# EasyEDA Pro project EasyEDApro.epro, schematic Power board
Create Date: 2024-05-27; Page Name: P1; Project Name: Robonomics SWS 2 GANG; Schematic Name: Power board; Update Date: 2024-05-27; Company: Robonomics.network; Drawed: ludovich88; Page Size: A4; Part Number: SWS-1G-E-ESP_PB; Reviewed: ludovich88; Version: V0.1
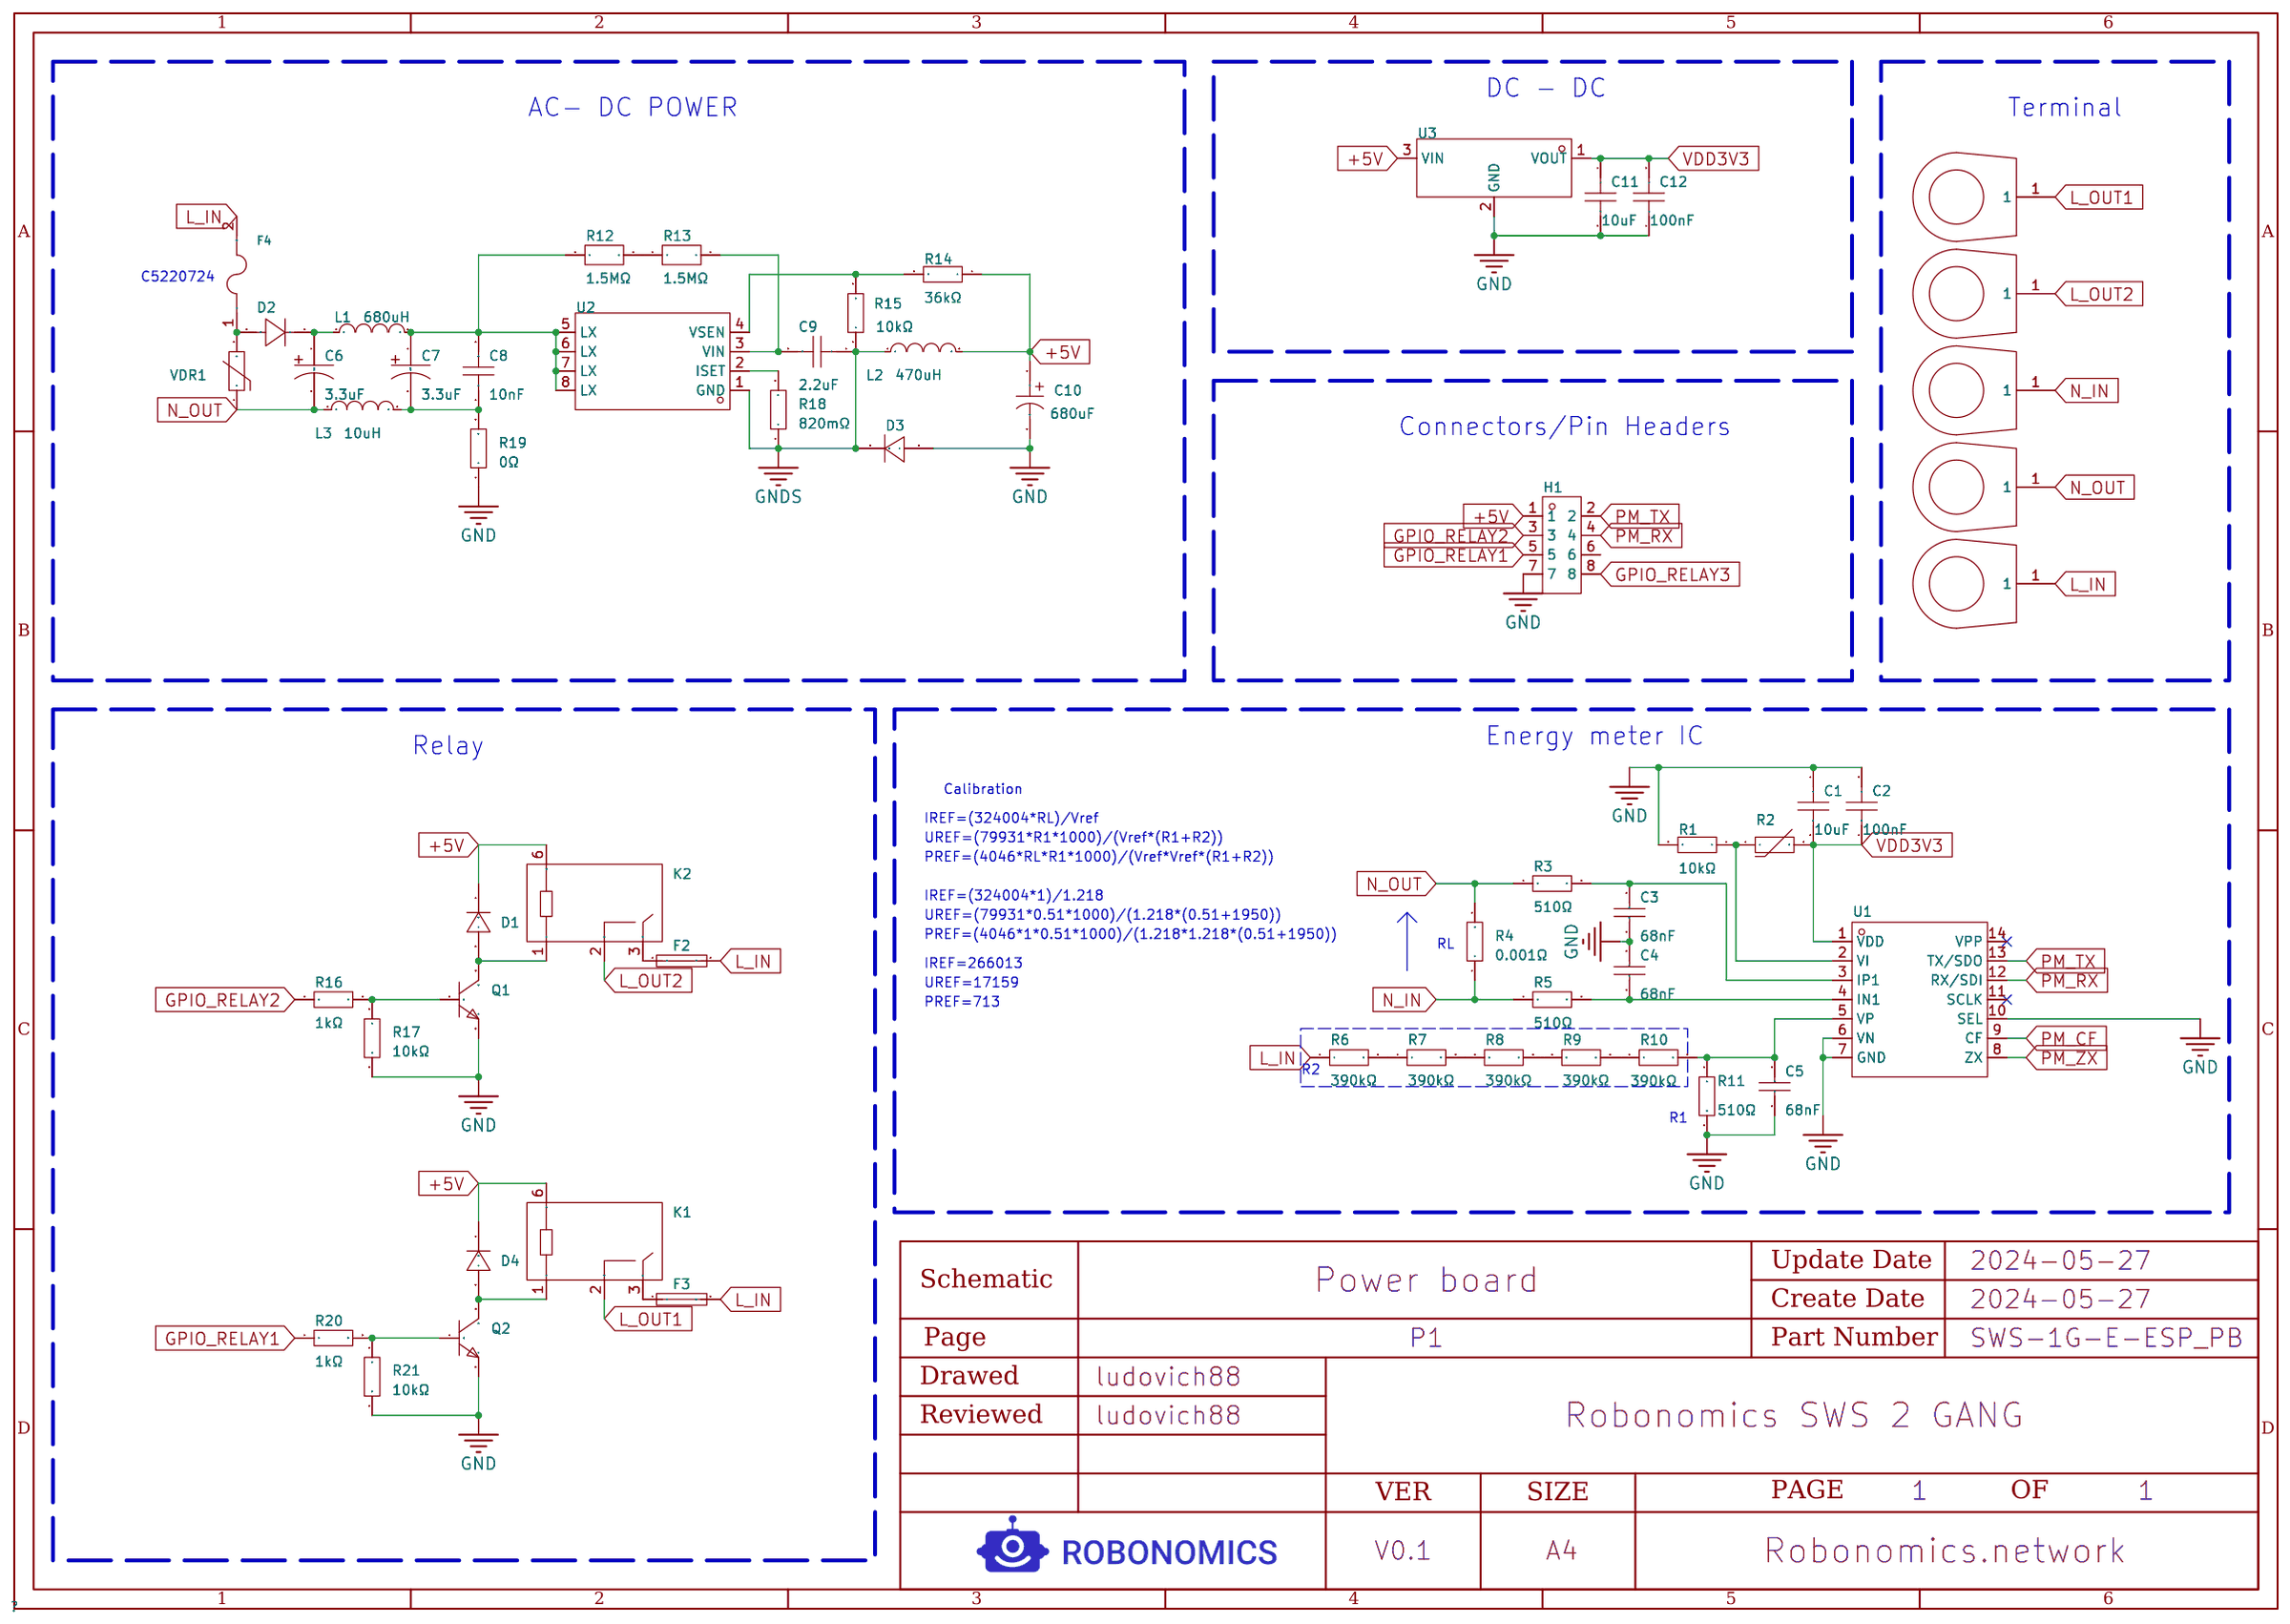
[diagram p0: schematic sheet]

## Parts
C1  10uF  [C0603]
C2  100nF  [C0603]
C3  68nF  [C0603]
C4  68nF  [C0603]
C5  68nF  [C0603]
C6  3.3uF  [CAP-TH_BD8.0-P3.50-D0.6-FD]
C7  3.3uF  [CAP-TH_BD8.0-P3.50-D0.6-FD]
C8  10nF  [C1206]
C9  2.2uF  [C0805]
C10  680uF  [CAP-TH_BD8.0-P3.50-D0.6-FD]
C11  10uF  [C0603]
C12  100nF  [C0603]
D1  -  [SOD-323_L1.8-W1.3-LS2.5-RD]
D2  -  [SMA_L4.3-W2.6-LS5.2-RD]
D3  -  [SMA_L4.3-W2.6-LS5.2-RD]
D4  -  [SOD-323_L1.8-W1.3-LS2.5-RD]
F2  -  [FUSE-SMD_L6.1-W2.6]
F3  -  [FUSE-SMD_L6.1-W2.6]
F4  JFC2410-1200FS  [F2410]
H1  -  [HDR-TH_8P-P2.00-V-M-R2-C4-S2.00]
K1  -  [RELAYS-TH_HF46F-G-XX-HS1-XXX]
K2  -  [RELAYS-TH_HF46F-G-XX-HS1-XXX]
L1  680uH  [IND-TH_BD9.0-P5.00-D0.7]
L2  470uH  [IND-SMD_L4.0-W4.0]
L3  10uH  [IND-SMD_L5.4-W5.2]
Q1  -  [SOT-23-3_L2.9-W1.6-P1.90-LS2.8-BR]
Q2  -  [SOT-23-3_L2.9-W1.6-P1.90-LS2.8-BR]
R1  10kΩ  [R0603]
R2  -  [R0805]
R3  510Ω  [R0603]
R4  0.001Ω  [RES-SMD_L6.3-W3.1-1]
R5  510Ω  [R0603]
R6  390kΩ  [R0603]
R7  390kΩ  [R0603]
R8  390kΩ  [R0603]
R9  390kΩ  [R0603]
R10  390kΩ  [R0603]
R11  510Ω  [R0603]
R12  1.5MΩ  [R1206]
R13  1.5MΩ  [R1206]
R14  36kΩ  [R0805]
R15  10kΩ  [R0805]
R16  1kΩ  [R0603]
R17  10kΩ  [R0603]
R18  820mΩ  [R0805]
R19  0Ω  [R0805]
R20  1kΩ  [R0603]
R21  10kΩ  [R0603]
U1  -  [TSSOP-14_L5.0-W4.4-P0.65-LS6.4-BL]
U2  -  [SOIC-8_L4.9-W3.9-P1.27-LS6.0-BL]
U3  -  [SOT-89-3_L4.5-W2.5-P1.50-LS4.2-BR]
U4  -  [screw_china_vadim]  (no BOM)
U5  -  [screw_china_vadim]  (no BOM)
U6  -  [screw_china_vadim]  (no BOM)
U7  -  [screw_china_vadim]  (no BOM)
U8  -  [screw_china_vadim]  (no BOM)
VDR1  RM07D471KC14E100  [RES-TH_L9.5-W3.8-P5.08-D0.6-S2.5]

## Library data of the parts
C1 C11 = CL10A106MQ8NNNC: Capacitance:Tolerance:±20%Tolerance:±20%VoltageRated:TemperatureCoefficient:; LCSC Part Name: 10uF±20%6.3V; Supplier Part: C1691; Manufacturer: SAMSUNG(三星); Supplier Footprint: 0603; JLCPCB Part Class: ExtendedPart; Datasheet: https://atta.szlcsc.com/upload/public/pdf/source/20160103/1457707690948.pdf; Supplier: LCSC; Tolerance: ±20%
C2 C12 = 0603ZC104KAT2A: Capacitance:Tolerance:±10%Tolerance:±10%VoltageRated:TemperatureCoefficient:; LCSC Part Name: 100nF±10%10V; Supplier Part: C597251; Manufacturer: KyoceraAVX; Supplier Footprint: 0603; Datasheet: https://atta.szlcsc.com/upload/public/pdf/source/20200611/C596996_5C2870FCBE04273D0B42880C13DA8C38.pdf; Supplier: LCSC; Tolerance: ±10%
C3-C5 = CC0603KRX7R9BB683: Capacitance:Tolerance:±10%Tolerance:±10%VoltageRated:TemperatureCoefficient:; LCSC Part Name: 68nF±10%50V; Supplier Part: C107098; Manufacturer: YAGEO(国巨); Supplier Footprint: 0603; JLCPCB Part Class: ExtendedPart; Datasheet: https://atta.szlcsc.com/upload/public/pdf/source/20170420/1492670727030.pdf; Supplier: LCSC; Tolerance: ±10%
C6 C7 = RC400M3R3LO8*12TH-2A1E: Capacitance:Tolerance:±20%Tolerance:±20%RatedVoltage:φD:L:LeadSpacing:RippleCurrent:-Lifetime@Temp:-OperatingTemperature:-40℃~+105℃OperatingTemperature:-40℃~+105℃; LCSC Part Name: 3.3uF±20%400V; Supplier Part: C357600; Manufacturer: BERYL(绿宝石); Supplier Footprint: 插件,D8xL12mm; JLCPCB Part Class: ExtendedPart; Datasheet: https://atta.szlcsc.com/upload/public/pdf/source/20190103/C357600_EA153F20CFA28085E3801EB936F22A0F.pdf; Supplier: LCSC; Tolerance: ±20%; Operating Temperature: -40℃~+105℃
C8 = 1206B103K102CT_C77498: Capacitance:Tolerance:±10%Tolerance:±10%VoltageRated:TemperatureCoefficient:; LCSC Part Name: 10nF±10%1kV; Supplier Part: C77498; Manufacturer: Walsin(华新科); Manufacturer Part: 1206B103K102CT; Supplier Footprint: 1206; Datasheet: https://atta.szlcsc.com/upload/public/pdf/source/20180823/C77498_F5DB9DEE771DDE1CDD0779C01702A5D3.pdf; Supplier: LCSC; Tolerance: ±10%
C9 = CL21A225KBQNNNE: Capacitance:Tolerance:±10%Tolerance:±10%VoltageRated:TemperatureCoefficient:; LCSC Part Name: 2.2uF±10%50V; Supplier Part: C377773; Manufacturer: SAMSUNG(三星); Supplier Footprint: 0805; JLCPCB Part Class: ExtendedPart; Datasheet: https://atta.szlcsc.com/upload/public/pdf/source/20190327/C377773_F663556E8B678C5EA7A210E6B154453B.pdf; Supplier: LCSC; Tolerance: ±10%
C10 = EPPC1C681M08112BS: Type:Capacitance:Tolerance:±20%Tolerance:±20%RatedVoltage:φD:-L:-LeadSpacing:-RippleCurrent:-EquivalentSeriesResistance(ESR):-Lifetime@Temp:-; LCSC Part Name: 680uF±20%16V; Supplier Part: C2803468; Manufacturer: FSD-CON(富仕达); Supplier Footprint: 径向引线,8x12mm; JLCPCB Part Class: ExtendedPart; Datasheet: https://atta.szlcsc.com/upload/public/pdf/source/20210616/C2803468_7FB11B187CD21C9D4AD2E759CF8C7DA5.pdf; Supplier: LCSC; Tolerance: ±20%
D1 D4 = 1N4148WS-7-F: DiodeConfiguration:PowerDissipation:ReverseVoltage(Vr):AverageRectifiedCurrent(Io):ForwardVoltage(Vf@If):1.25V@150mAReverseLeakageCurrent:1uA@75VReverseRecoveryTime(trr):OperatingTemperature:-65℃~+150℃@(Tj)OperatingTemperature:-65℃; LCSC Part Name: 75V150mA4ns; Supplier Part: C60580; Manufacturer: DIODES(美台); Supplier Footprint: SOD-323; Datasheet: https://atta.szlcsc.com/upload/public/pdf/source/20160107/1457707747110.pdf; Supplier: LCSC; Forward Voltage (Vf@If): 1.25V@150mA; Reverse Leakage Current: 1uA@75V; Operating Temperature: -65℃~+150℃@(Tj)
D2 = 1N4007_C2909962: DiodeConfiguration:ReverseVoltage(Vr):AverageRectifiedCurrent(Io):ForwardVoltage(Vf@If):1.1V@1AReverseLeakageCurrent:5uA@1kV; LCSC Part Name: 1kV1A1.1V@1A; Supplier Part: C2909962; Manufacturer: YONGYUTAI(永裕泰); Manufacturer Part: 1N4007; Supplier Footprint: SMA; JLCPCB Part Class: ExtendedPart; Datasheet: https://atta.szlcsc.com/upload/public/pdf/source/20211027/3C3C26B7E3DDAB11EE78A0D524F57BB8.pdf; Supplier: LCSC; Forward Voltage (Vf@If): 1.1V@1A; Reverse Leakage Current: 5uA@1kV
D3 = ES1J_C115404: LCSC Part Name: ES1J; Supplier Part: C115404; Manufacturer: 晶导微电子; Manufacturer Part: ES1J; Supplier Footprint: SMA(DO-214AC); Datasheet: https://atta.szlcsc.com/upload/public/pdf/source/20170704/1499151315665.pdf; Supplier: LCSC
F2 F3 = 24E1700A: FuseType:-BreakingCapacity@RatedVoltage:50AProduct:SMDCeramicFuseOperatingTemperature:RatedVoltage(DC):CurrentRating:NominalVoltageDrop:-MeltingI²t:RatedVoltage(AC):250VNominalColdResistance:-; LCSC Part Name: 7A250V熔断式; Supplier Part: C182452; Manufacturer: LANSON(良胜); Supplier Footprint: SMD; JLCPCB Part Class: ExtendedPart; Datasheet: https://atta.szlcsc.com/upload/public/pdf/source/20180301/C182452_15198945619091384126.pdf; Supplier: LCSC; Breaking Capacity @ Rated Voltage: 50A; Product: SMDCeramicFuse; Rated Voltage(AC): 250V
F4 = JFC2410-1200FS: Type:SMD Fuse Current Rating:2A Voltage Rating  (AC):250V Breaking Capacity:50A Operating Temperature:-55℃~+125℃ Operating Temperature:-55℃~+125℃; LCSC Part Name: 250V贴片式保险丝; Supplier Part: C136365; Manufacturer: JDTfuse(集电通); Supplier Footprint: SMD; JLCPCB Part Class: Extended Part; Datasheet: https://atta.szlcsc.com/upload/public/pdf/source/20230515/4DD82964BD259009D7CA201DAB95185E.pdf; Supplier: LCSC; Type: SMD Fuse; Current Rating: 2A; Voltage Rating  (AC): 250V; Breaking Capacity: 50A; Operating Temperature: -55℃~+125℃
H1 = DZ200R-22-08-39: NumberofRows:双排NumberofPins:8Pitch:2mmPinStructure:2x4PRowSpacing:2mmMountingType:StraightCircluarPins/SquarePins:SquarePinsCurrentRating(Max):1.5AVoltageRating(Max):-LengthofMatingPin:3.9mmInsulationHeight:2mmLengthofEndCo; LCSC Part Name: 2mm2x4P直插方针; Supplier Part: C2935959; Manufacturer: DEALON(德艺隆); Supplier Footprint: 插件,P=2mm; Datasheet: https://atta.szlcsc.com/upload/public/pdf/source/20211231/68D7D2A8F9A773B01A999B43160B79F2.pdf; Supplier: LCSC; Number of Rows: 双排; Number of Pins: 8; Pitch: 2mm; Pin Structure: 2x4P; Row Spacing: 2mm; Mounting Type: Straight; Circluar Pins/Square Pins: SquarePins; Current Rating (Max): 1.5A; Length of Mating Pin: 3.9mm; Insulation Height: 2mm; Length of End Connection Pin: 2.7mm
K1 K2 = HF46F-G/005-HS1: CoilVoltage:5VCoilType:非极化-单线圈PinNumber:4ContactForm:一组常开:1A(SPST-常开)MaximumSwitchingCurrent:10AMaximumSwitchingVoltage:277V@AC；30V@DCCoilRatedPower:200mWContactRating:10A@250VAC；10A@30VDCCoilResistance:125ΩOperateTime:10msReleaseT; Supplier Part: C2976854; Manufacturer: HF(宏发); Supplier Footprint: 插件,7x20.5mm; Datasheet: https://atta.szlcsc.com/upload/public/pdf/source/20220224/E14005FDD5D9726CCDC1C5F41EB581E0.pdf; Supplier: LCSC; Coil Voltage: 5V; Coil Type: 非极化-单线圈; Pin Number: 4; Contact Form: 一组常开:1A(SPST-常开); Maximum Switching Current: 10A; Maximum Switching Voltage: 277V@AC；30V@DC; Coil Rated Power: 200mW; Contact Rating: 10A@250VAC；10A@30VDC; Coil Resistance: 125Ω; Operate Time: 10ms; Release Time: 10ms; Contact Resistance: 100mΩ; Contact Material: AgNi; Operating Temperature: -40℃~+85℃
L1 = PK0810-681KB: Inductance:Tolerance:Tolerance:RatedCurrent:DCResistance(DCR):-; LCSC Part Name: 680uH±10%350mA; Supplier Part: C400320; Manufacturer: SXN(顺翔诺); Supplier Footprint: 径向引线; JLCPCB Part Class: ExtendedPart; Datasheet: https://atta.szlcsc.com/upload/public/pdf/source/20210810/BA6D1DA7D4BCBB7C641BC97B42CFC6FF.pdf; Supplier: LCSC
L2 = PNLS4030-471: Inductance: Tolerance:±20% Tolerance:±20% Rated Current: Type:磁胶电感 DC Resistance (DCR): Saturation Current (Isat):- Ratings:-; LCSC Part Name: 470uH ±20%; Supplier Part: C2849480; Manufacturer: DMBJ(振宝佳); Supplier Footprint: SMD,4x4x3mm; JLCPCB Part Class: Extended Part; Datasheet: https://atta.szlcsc.com/upload/public/pdf/source/20211011/C2849563_90EF936162E15AB6B17B47214801A168.pdf; Supplier: LCSC; Tolerance: ±20%; Type: 磁胶电感; DC Resistance (DCR): 2.57Ω
L3 = YSPI0530-100M: RatedCurrent:Inductance:Length:Tolerance:Width:DCResistance(DCR):Height:Tolerance:; LCSC Part Name: 10uH±20%2.5A115mΩ; Supplier Part: C351099; Manufacturer: YJYCOIN(益嘉源); Supplier Footprint: SMD,5.4x5.2x3mm; Datasheet: https://atta.szlcsc.com/upload/public/pdf/source/20200623/C351094_17389D97D1B03B4819FE4163F927344F.pdf; Supplier: LCSC
Q1 Q2 = SS8050_C181160: TransistorType:Collector-EmitterBreakdownVoltage(Vceo):CollectorCurrent(Ic):PowerDissipation(Pd):CollectorCut-OffCurrent(Icbo):100nACollector-EmitterSaturationVoltage(VCE(sat)@Ic,Ib):500mV@800mA,80mADCCurrentGain(hFE@Ic,Vce):200@100; LCSC Part Name: NPN25V1.5AH档（200-350）; Supplier Part: C181160; Manufacturer: Hottech(合科泰); Manufacturer Part: SS8050; Supplier Footprint: SOT-23; JLCPCB Part Class: ExtendedPart; Datasheet: https://atta.szlcsc.com/upload/public/pdf/source/20220506/87BBA77FEE9CB4B19031AE933C67329E.pdf; Supplier: LCSC; Collector Cut-Off Current (Icbo): 100nA; Collector-Emitter Saturation Voltage (VCE(sat)@Ic,Ib): 500mV@800mA,80mA; DC Current Gain (hFE@Ic,Vce): 200@100mA,1V; Transition Frequency (fT): 100MHz; Operating Temperature: +150℃@(Tj)
R1 R17 R21 = 0603WAF1002T5E: Resistance:10000Ω Tolerance:±1% Tolerance:±1% Power(Watts): Overload Voltage (Max): Temperature Coefficient:±100ppm/℃ Temperature Coefficient:±100ppm/℃ Type:Thick Film Resistors Operating Temperature Range:-55℃~+155℃ Operating Temperature Range:-55℃~+155℃; LCSC Part Name: 10kΩ ±1% 100mW 厚膜电阻; Supplier Part: C25804; Manufacturer: UNI-ROYAL(厚声); Supplier Footprint: 0603; JLCPCB Part Class: Basic Part; Datasheet: https://atta.szlcsc.com/upload/public/pdf/source/20200306/C422600_1E6D84923E4A46A82E41ADD87F860B5C.pdf; Supplier: LCSC; Tolerance: ±1%; Power(Watts): 1/10W; Overload Voltage (Max): 75V; Temperature Coefficient: ±100ppm/℃; Type: Thick Film Resistors; Operating Temperature Range: -55℃~+155℃
R2 = SDNT2012X103F3950FTF: Resistance@25℃:ResistanceTolerance:BConstantTolerance:BConstant(25℃/50℃):Power:SteadyStateCurrent(Max):0.44mABConstant(25℃/75℃):-BConstant(25℃/85℃):-BConstant(25℃/100℃):-OperatingTemperature:-55℃~+125℃OperatingTemperature:-55℃~; LCSC Part Name: 10kΩ电阻精度:±1%3950K; Supplier Part: C95968; Manufacturer: Sunlord(顺络); Supplier Footprint: 0805; JLCPCB Part Class: ExtendedPart; Datasheet: https://atta.szlcsc.com/upload/public/pdf/source/20210916/BF106A3565EDFEB141CB3E0EA3A661F8.pdf; Supplier: LCSC; Steady State Current (Max): 0.44mA; Operating Temperature: -55℃~+125℃
R3 R5 R11 = 0603WAD5100T5E: Resistance: Tolerance:±0.5% Tolerance:±0.5% Power(Watts): Overload Voltage (Max): Temperature Coefficient:±100ppm/℃ Temperature Coefficient:±100ppm/℃ Type:Thick Film Resistors Operating Temperature Range:-55℃~+155℃ Operating Temperature Range:-55℃~+155℃; LCSC Part Name: 510Ω ±0.5% 100mW 厚膜电阻; Supplier Part: C423029; Manufacturer: UNI-ROYAL(厚声); Supplier Footprint: 0603; JLCPCB Part Class: Extended Part; Datasheet: https://atta.szlcsc.com/upload/public/pdf/source/20200306/C422600_1E6D84923E4A46A82E41ADD87F860B5C.pdf; Supplier: LCSC; Tolerance: ±0.5%; Temperature Coefficient: ±100ppm/℃; Type: Thick Film Resistors; Operating Temperature Range: -55℃~+155℃
R4 = EWSL2512F1L00S9: Tolerance:MountingSytle:SurfaceMountBodyLength:-BodyWidth:-BodyHeight:-Power(Watts):TemperatureCoefficient:TemperatureCoefficient:LeadSpacing:-Resistance:Type:CurrentSensingResistorsRatedCurrent:-RatedOutputVoltage:-; LCSC Part Name: 0.001Ω±1%; Supplier Part: C349153; Manufacturer: RESI(开步睿思）; Supplier Footprint: 2512; JLCPCB Part Class: ExtendedPart; Datasheet: https://atta.szlcsc.com/upload/public/pdf/source/20181218/C349153_CC7FEA2167C118B4D238105DB1321D0D.pdf; Supplier: LCSC; Mounting Sytle: SurfaceMount; Type: CurrentSensingResistors
R6-R10 = 0603WAF3903T5E: Type:Thick Film Resistors Resistance: Tolerance:±1% Tolerance:±1% Power(Watts): Temperature Coefficient:±100ppm/ Temperature Coefficient:±100ppm/ Overload Voltage (Max): Operating Temperature Range:-55~+155 Operating Temperature Range:-55~+155; LCSC Part Name: 390kΩ±1%100mW; Supplier Part: C23150; Manufacturer: UNI-ROYAL(厚声); Supplier Footprint: 0603; JLCPCB Part Class: BasicPart; Datasheet: https://atta.szlcsc.com/upload/public/pdf/source/20200306/C422600_1E6D84923E4A46A82E41ADD87F860B5C.pdf; Supplier: LCSC; Type: ThickFilmResistors; Tolerance: ±1%; Temperature Coefficient: ±100ppm/; Operating Temperature Range: -55~+155
R12 R13 = AC1206FR-071M5L: Power(Watts):250mWBodyLength:-Tolerance:OperatingTemperatureRange:OperatingTemperatureRange:φD:-BodyHeight:-Resistance:BodyWidth:-Type:ThickFilmResistorsTemperatureCoefficient:TemperatureCoefficient:OverloadVoltage(Max):; LCSC Part Name: 1.5MΩ±1%; Supplier Part: C229411; Manufacturer: YAGEO(国巨); Supplier Footprint: 1206; JLCPCB Part Class: ExtendedPart; Datasheet: https://atta.szlcsc.com/upload/public/pdf/source/20190415/C229411_FA1574342AB9C159EA3612F925293BBE.pdf; Supplier: LCSC; Power(Watts): 250mW; Type: ThickFilmResistors
R14 = 0805W8F3602T5E: Type:ThickFilmResistorsResistance:Tolerance:±1%Tolerance:±1%Power(Watts):TemperatureCoefficient:±100ppm/℃TemperatureCoefficient:±100ppm/℃OverloadVoltage(Max):OperatingTemperatureRange:-55℃~+155℃OperatingTemperatureRange:-55℃~+155℃; LCSC Part Name: 36kΩ±1%125mW; Supplier Part: C4360; Manufacturer: UNI-ROYAL(厚声); Supplier Footprint: 0805; JLCPCB Part Class: BasicPart; Datasheet: https://atta.szlcsc.com/upload/public/pdf/source/20200306/C422600_1E6D84923E4A46A82E41ADD87F860B5C.pdf; Supplier: LCSC; Type: ThickFilmResistors; Tolerance: ±1%; Temperature Coefficient: ±100ppm/℃; Operating Temperature Range: -55℃~+155℃
R15 = 0805W8F1002T5E: Type:ThickFilmResistorsResistance:Tolerance:±1%Tolerance:±1%Power(Watts):TemperatureCoefficient:±100ppm/℃TemperatureCoefficient:±100ppm/℃OverloadVoltage(Max):OperatingTemperatureRange:-55℃~+155℃OperatingTemperatureRange:-55℃~+155℃; LCSC Part Name: 10kΩ±1%125mW; Supplier Part: C17414; Manufacturer: UNI-ROYAL(厚声); Supplier Footprint: 0805; JLCPCB Part Class: BasicPart; Datasheet: https://atta.szlcsc.com/upload/public/pdf/source/20200306/C422600_1E6D84923E4A46A82E41ADD87F860B5C.pdf; Supplier: LCSC; Type: ThickFilmResistors; Tolerance: ±1%; Temperature Coefficient: ±100ppm/℃; Operating Temperature Range: -55℃~+155℃
R16 R20 = 0603WAF1001T5E: Resistance:1000Ω Tolerance:±1% Tolerance:±1% Power(Watts): Overload Voltage (Max): Temperature Coefficient:±100ppm/℃ Temperature Coefficient:±100ppm/℃ Type:Thick Film Resistors Operating Temperature Range:-55℃~+155℃ Operating Temperature Range:-55℃~+155℃; LCSC Part Name: 1kΩ ±1% 100mW 厚膜电阻; Supplier Part: C21190; Manufacturer: UNI-ROYAL(厚声); Supplier Footprint: 0603; JLCPCB Part Class: Basic Part; Datasheet: https://atta.szlcsc.com/upload/public/pdf/source/20200306/C422600_1E6D84923E4A46A82E41ADD87F860B5C.pdf; Supplier: LCSC; Tolerance: ±1%; Temperature Coefficient: ±100ppm/℃; Type: Thick Film Resistors; Operating Temperature Range: -55℃~+155℃
R18 = 0805W8F820LT5E: Type:ThickFilmResistorsResistance:820mΩTolerance:±1%Tolerance:±1%Power(Watts):TemperatureCoefficient:±800ppm/℃TemperatureCoefficient:±800ppm/℃OverloadVoltage(Max):OperatingTemperatureRange:-55℃~+155℃OperatingTemperatureRange:-55℃~+155℃; LCSC Part Name: 820mΩ±1%125mW; Supplier Part: C25267; Manufacturer: UNI-ROYAL(厚声); Supplier Footprint: 0805; JLCPCB Part Class: ExtendedPart; Datasheet: https://atta.szlcsc.com/upload/public/pdf/source/20200306/C422600_1E6D84923E4A46A82E41ADD87F860B5C.pdf; Supplier: LCSC; Type: ThickFilmResistors; Tolerance: ±1%; Temperature Coefficient: ±800ppm/℃; Operating Temperature Range: -55℃~+155℃
R19 = 0805W8J0000T5E: Type:ThickFilmResistorsResistance:Tolerance:±5%Tolerance:±5%Power(Watts):OverloadVoltage(Max):OperatingTemperatureRange:-55℃~+155℃OperatingTemperatureRange:-55℃~+155℃; LCSC Part Name: 0Ω±5%125mW; Supplier Part: C25275; Manufacturer: UNI-ROYAL(厚声); Supplier Footprint: 0805; Datasheet: https://atta.szlcsc.com/upload/public/pdf/source/20200306/C422600_1E6D84923E4A46A82E41ADD87F860B5C.pdf; Supplier: LCSC; Type: ThickFilmResistors; Tolerance: ±5%; Operating Temperature Range: -55℃~+155℃
U1 = BL0940: LCSC Part Name: 电能计量芯片; Supplier Part: C691894; Manufacturer: BL(上海贝岭); Supplier Footprint: TSSOP-14; JLCPCB Part Class: ExtendedPart; Datasheet: https://atta.szlcsc.com/upload/public/pdf/source/20200628/C691894_DF23B4F5A06D0F64D9A7C5BC935783C1.pdf; Supplier: LCSC
U2 = SY50282FAC: Supplier Part: C178237; Manufacturer: silergy(矽力杰); Supplier Footprint: SOIC-8; JLCPCB Part Class: ExtendedPart; Datasheet: https://atta.szlcsc.com/upload/public/pdf/source/20180207/C178237_15179896323851356347.pdf; Supplier: LCSC
U3 = LD2981ABU33TR: OutputType:OutputPolarity:PositiveNumberofOutputs:1MaximumInputVoltage:16VOutputVoltage:3.3V~3.3VOutputVoltage:3.3V~3.3VDropoutVoltage:375mV@(100mA)OutputCurrent:100mAPowerSupplyRejectionRatio(PSRR):63dB@(1kHz); LCSC Part Name: 正Vin=16VVout=3.3V100mA63dB@(1kHz); Supplier Part: C221514; Manufacturer: ST(意法半导体); Supplier Footprint: SOT-89-3; JLCPCB Part Class: ExtendedPart; Datasheet: https://atta.szlcsc.com/upload/public/pdf/source/20180517/C221514_2D86246316B4A3FA0379065A5BE313C7.pdf; Supplier: LCSC; Output Polarity: Positive; Number of Outputs: 1; Maximum Input Voltage: 16V; Output Voltage: 3.3V~3.3V; Dropout Voltage: 375mV@(100mA); Output Current: 100mA; Power Supply Rejection Ratio (PSRR): 63dB@(1kHz)
U4-U8 = screw_china_vadim
VDR1 = RM07D471KC14E100: Varistor Voltage:470V Varistor Voltage:470V Clamping Voltage: Allowable Voltage (DC): Allowable Voltage (AC): Peak Current:1250A Maximum Energy:29J Maximum Energy:29J Typical Capatitance:105pF@1kHz Rated Wattage:0.25W; LCSC Part Name: 钳位电压775V 29焦耳 插件压敏电阻; Supplier Part: C2974819; Manufacturer: Dersonic(德尔创); Supplier Footprint: 插件,P=5.08mm; JLCPCB Part Class: Extended Part; Datasheet: https://atta.szlcsc.com/upload/public/pdf/source/20220216/D8DC692F05B9B06F05572F275B453E59.pdf; Supplier: LCSC; Varistor Voltage: 470V; Peak Current: 1250A; Maximum Energy: 29J; Typical Capatitance: 105pF@1kHz; Rated Wattage: 0.25W

## Nets
+5V: C10.1 D1.1(C) D4.1(C) H1.1 K1.6 K2.6 L2.2 R14.1 U3.3(VIN)
GND: C1.1 C2.2 C3.1 C4.2 C5.1 C10.2 C11.2 C12.1 D3.2(A) H1.7 Q1.2(E) Q2.2(E) R1.2 R11.2 R17.2 R19.1 R21.2 U1.6(VN) U1.7(GND) U1.10(SEL) U3.2(GND)
GNDS: C9.1 D3.1(C) L2.1 R15.1 R18.1 U2.1(GND)
VDD3V3: C1.2 C2.1 C11.1 C12.2 R2.2 U1.1(VDD) U3.1(VOUT)
GPIO_RELAY1: H1.5 R20.1
GPIO_RELAY2: H1.3 R16.1
GPIO_RELAY3: H1.8
L_IN: F2.2 F3.2 F4.2 R6.1 U4.1
L_OUT1: K1.2 U8.1
L_OUT2: K2.2 U7.1
N_IN: R4.1 R5.1 U6.1
N_OUT: C6.2 L3.1 R3.1 R4.2 U5.1 VDR1.1
PM_CF: U1.9(CF)
PM_RX: H1.4 U1.12(RX/SDI)
PM_TX: H1.2 U1.13(TX/SDO)
PM_ZX: U1.8(ZX)
$1N1298: R6.2 R7.1
$1N1299: R7.2 R8.1
$1N1300: R8.2 R9.1
$1N1301: R9.2 R10.1
$1N1304: C4.1 R5.2 U1.4(IN1)
$1N1308: C3.2 R3.2 U1.3(IP1)
$1N1312: R1.1 R2.1 U1.2(VI)
$1N1323: C5.2 R10.2 R11.1 U1.5(VP)
$1N34042: Q2.1(B) R20.2 R21.1
$1N34045: D4.2(A) K1.1 Q2.3(C)
$1N34663: Q1.1(B) R16.2 R17.1
$1N34666: D1.2(A) K2.1 Q1.3(C)
$1N45269: C6.1 D2.1(K) L1.1
$1N45602: C7.1 C8.2 L1.2 R12.1 U2.5(LX) U2.6(LX) U2.7(LX) U2.8(LX)
$1N45640: C7.2 C8.1 L3.2 R19.2
$1N46486: R12.2 R13.1
$1N46932: R18.2 U2.2(ISET)
$1N47536: R14.2 R15.2 U2.4(VSEN)
$1N48801: C9.2 R13.2 U2.3(VIN)
$1N58982: F3.1 K1.3
$1N59380: F2.1 K2.3
$1N91130: D2.2(A) F4.1 VDR1.2

Not connected (* = marked no-connect by the designer): H1 6; U1 11(SCLK)* 14(VPP)*

## Notes on the sheet
- DC - DC
- AC- DC POWER
- Terminal
- C5220724
- Connectors/Pin Headers
- Energy meter IC
- Relay
- Calibration
- IREF=(324004*RL)/Vref
- UREF=(79931*R1*1000)/(Vref*(R1+R2))
- PREF=(4046*RL*R1*1000)/(Vref*Vref*(R1+R2))
- IREF=(324004*1)/1.218
- UREF=(79931*0.51*1000)/(1.218*(0.51+1950))
- PREF=(4046*1*0.51*1000)/(1.218*1.218*(0.51+1950))
- RL
- IREF=266013
- UREF=17159
- PREF=713
- R2
- R1
